# EAGLE design dynalo_SMD_MOD (EAGLE 9.4.2)
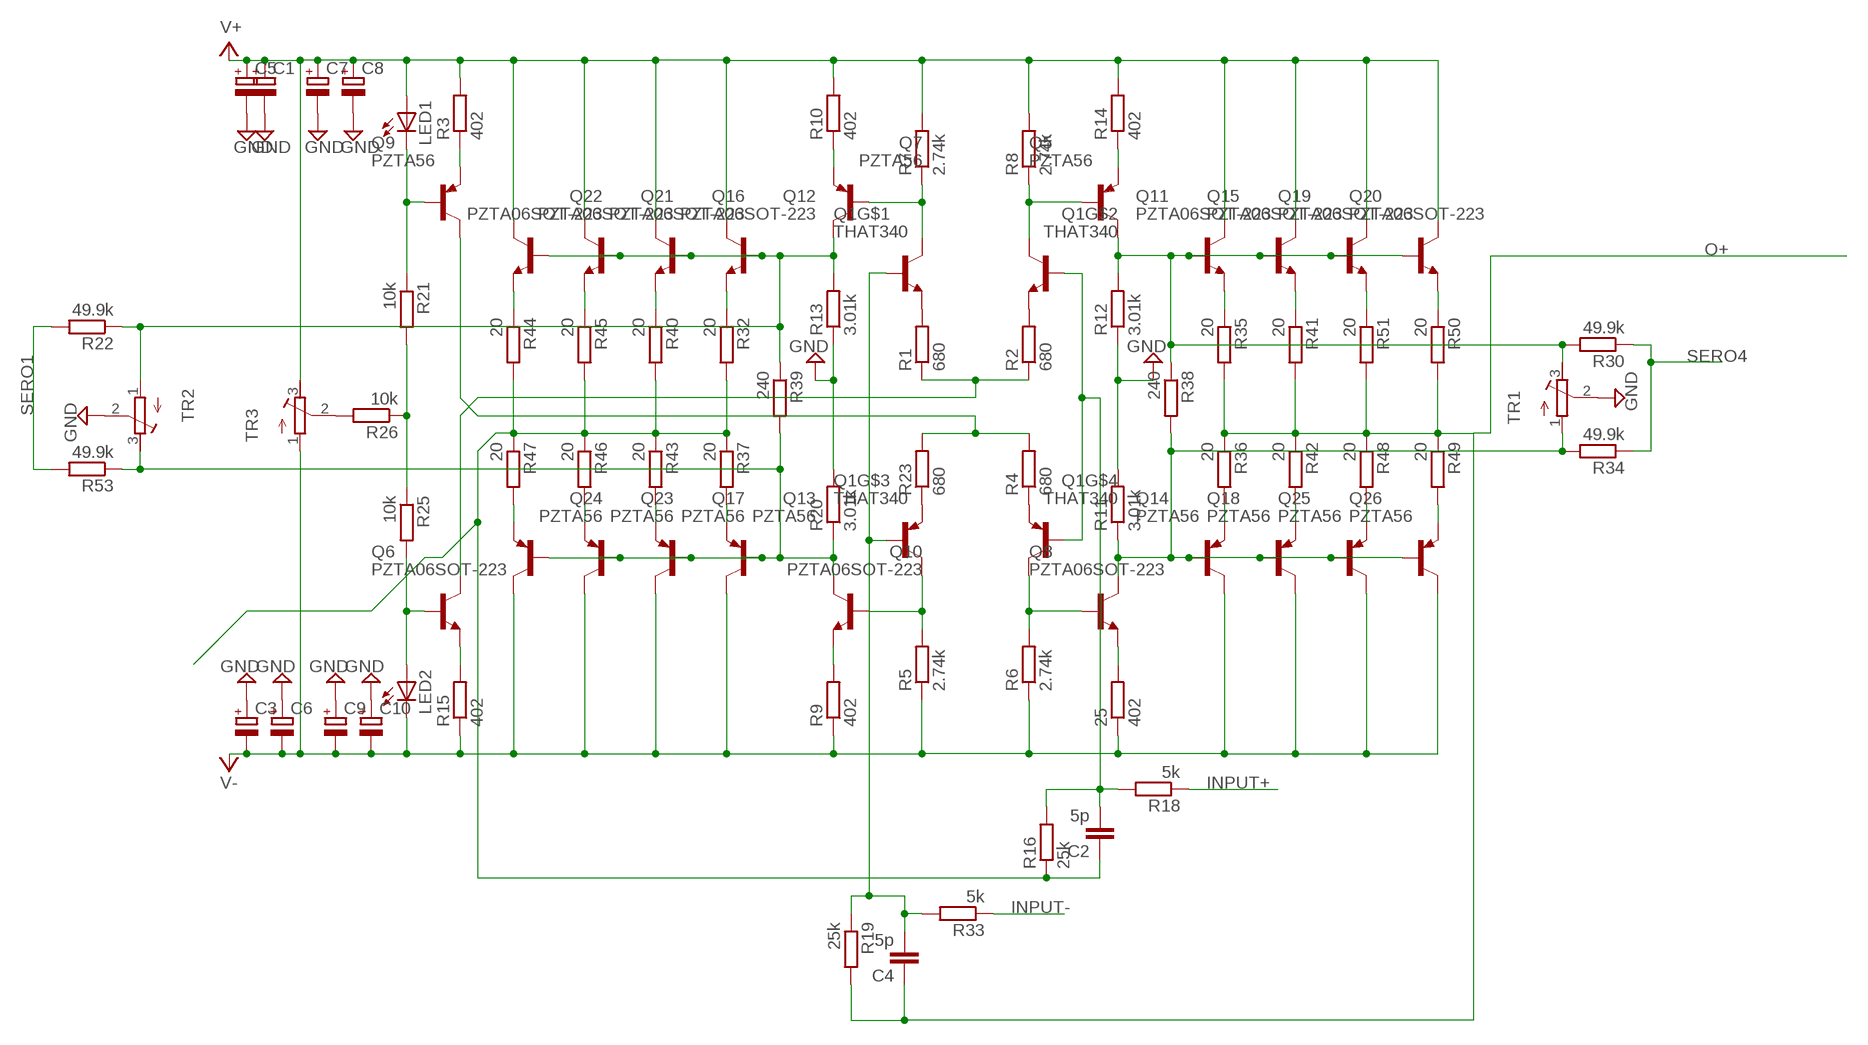
[diagram p0: schematic, sheet 1]

## Parts
25  402  R-EU_MELF0204W  [MINI_MELF-0204W]
C1  CPOL-EUSP-CAP-CX  [SP-CAP-CX]
C2  5p  C-EUC0805  [C0805]
C3  CPOL-EUSP-CAP-CX  [SP-CAP-CX]
C4  5p  C-EUC0805  [C0805]
C5  CPOL-EUSP-CAP-CX  [SP-CAP-CX]
C6  CPOL-EUSP-CAP-CX  [SP-CAP-CX]
C7  CPOL-EUSP-CAP-CX  [SP-CAP-CX]
C8  CPOL-EUSP-CAP-CX  [SP-CAP-CX]
C9  CPOL-EUSP-CAP-CX  [SP-CAP-CX]
C10  CPOL-EUSP-CAP-CX  [SP-CAP-CX]
LED1  LED5MM  [LED5MM]
LED2  LED5MM  [LED5MM]
Q1  THAT340  [DIP254P762X510-14]
Q5  PZTA56  [SOT223]
Q6  PZTA06SOT-223  [SOT223]
Q7  PZTA56  [SOT223]
Q8  PZTA06SOT-223  [SOT223]
Q9  PZTA56  [SOT223]
Q10  PZTA06SOT-223  [SOT223]
Q11  PZTA06SOT-223  [SOT223]
Q12  PZTA06SOT-223  [SOT223]
Q13  PZTA56  [SOT223]
Q14  PZTA56  [SOT223]
Q15  PZTA06SOT-223  [SOT223]
Q16  PZTA06SOT-223  [SOT223]
Q17  PZTA56  [SOT223]
Q18  PZTA56  [SOT223]
Q19  PZTA06SOT-223  [SOT223]
Q20  PZTA06SOT-223  [SOT223]
Q21  PZTA06SOT-223  [SOT223]
Q22  PZTA06SOT-223  [SOT223]
Q23  PZTA56  [SOT223]
Q24  PZTA56  [SOT223]
Q25  PZTA56  [SOT223]
Q26  PZTA56  [SOT223]
R1  680  R-EU_MELF0204W  [MINI_MELF-0204W]
R2  680  R-EU_MELF0204W  [MINI_MELF-0204W]
R3  402  R-EU_MELF0204W  [MINI_MELF-0204W]
R4  680  R-EU_MELF0204W  [MINI_MELF-0204W]
R5  2.74k  R-EU_MELF0204W  [MINI_MELF-0204W]
R6  2.74k  R-EU_MELF0204W  [MINI_MELF-0204W]
R7  2.74k  R-EU_MELF0204W  [MINI_MELF-0204W]
R8  2.74k  R-EU_MELF0204W  [MINI_MELF-0204W]
R9  402  R-EU_MELF0204W  [MINI_MELF-0204W]
R10  402  R-EU_MELF0204W  [MINI_MELF-0204W]
R11  3.01k  R-EU_MELF0204W  [MINI_MELF-0204W]
R12  3.01k  R-EU_MELF0204W  [MINI_MELF-0204W]
R13  3.01k  R-EU_MELF0204W  [MINI_MELF-0204W]
R14  402  R-EU_MELF0204W  [MINI_MELF-0204W]
R15  402  R-EU_MELF0204W  [MINI_MELF-0204W]
R16  25k  R-EU_MELF0204W  [MINI_MELF-0204W]
R18  5k  R-EU_MELF0204W  [MINI_MELF-0204W]
R19  25k  R-EU_MELF0204W  [MINI_MELF-0204W]
R20  3.01k  R-EU_MELF0204W  [MINI_MELF-0204W]
R21  10k  R-EU_MELF0204W  [MINI_MELF-0204W]
R22  49.9k  R-EU_MELF0204W  [MINI_MELF-0204W]
R23  680  R-EU_MELF0204W  [MINI_MELF-0204W]
R25  10k  R-EU_MELF0204W  [MINI_MELF-0204W]
R26  10k  R-EU_MELF0204W  [MINI_MELF-0204W]
R30  49.9k  R-EU_MELF0204W  [MINI_MELF-0204W]
R32  20  R-EU_MELF0204W  [MINI_MELF-0204W]
R33  5k  R-EU_MELF0204W  [MINI_MELF-0204W]
R34  49.9k  R-EU_MELF0204W  [MINI_MELF-0204W]
R35  20  R-EU_MELF0204W  [MINI_MELF-0204W]
R36  20  R-EU_MELF0204W  [MINI_MELF-0204W]
R37  20  R-EU_MELF0204W  [MINI_MELF-0204W]
R38  240  R-EU_MELF0204W  [MINI_MELF-0204W]
R39  240  R-EU_MELF0204W  [MINI_MELF-0204W]
R40  20  R-EU_MELF0204W  [MINI_MELF-0204W]
R41  20  R-EU_MELF0204W  [MINI_MELF-0204W]
R42  20  R-EU_MELF0204W  [MINI_MELF-0204W]
R43  20  R-EU_MELF0204W  [MINI_MELF-0204W]
R44  20  R-EU_MELF0204W  [MINI_MELF-0204W]
R45  20  R-EU_MELF0204W  [MINI_MELF-0204W]
R46  20  R-EU_MELF0204W  [MINI_MELF-0204W]
R47  20  R-EU_MELF0204W  [MINI_MELF-0204W]
R48  20  R-EU_MELF0204W  [MINI_MELF-0204W]
R49  20  R-EU_MELF0204W  [MINI_MELF-0204W]
R50  20  R-EU_MELF0204W  [MINI_MELF-0204W]
R51  20  R-EU_MELF0204W  [MINI_MELF-0204W]
R53  49.9k  R-EU_MELF0204W  [MINI_MELF-0204W]
TR1  R-TRIMM3296W  [RTRIM3296W]
TR2  R-TRIMM3296W  [RTRIM3296W]
TR3  R-TRIMM3296W  [RTRIM3296W]

## Nets
GND: C1.- C3.+ C5.- C6.+ C7.- C8.- C9.+ C10.+ R11.2 R12.1 R13.1 R20.2 TR1.2(S) TR2.2(S)
INPUT+: R18.1
INPUT-: R33.1
N$1: Q1.3(E) R1.2
N$2: Q1.12(E) R2.2
N$3: Q1.5(E) R23.1
N$4: Q1.10(E) R4.1
N$5: Q1.1(C) Q7.1(B) R7.1
N$6: Q1.14(C) Q5.1(B) R8.1
N$7: Q1.7(C) Q10.1(B) R5.2
N$8: Q1.8(C) Q8.1(B) R6.2
N$9: Q9.2(C) Q9.4(C) R4.2 R23.2
N$10: Q6.2(C) Q6.4(C) R1.1 R2.1
N$11: Q10.3(E) R9.2
N$12: Q7.3(E) R10.1
N$15: C4.2 Q1.2(B) Q1.6(B) R19.1 R33.2
N$16: C2.2 Q1.9(B) Q1.13(B) R16.2 R18.2
N$17: Q7.2(C) Q7.4(C) Q12.1(B) Q16.1(B) Q21.1(B) Q22.1(B) R13.2 R22.1 R39.1 TR2.1(A)
N$18: Q10.2(C) Q10.4(C) Q13.1(B) Q17.1(B) Q23.1(B) Q24.1(B) R20.1 R39.2 R53.1 TR2.3(E)
N$21: Q11.3(E) R35.1
N$22: Q5.2(C) Q5.4(C) Q11.1(B) Q15.1(B) Q19.1(B) Q20.1(B) R12.2 R30.2 R38.1 TR1.3(E)
N$23: 25.2 Q8.3(E)
N$24: Q14.3(E) R36.2
N$25: Q5.3(E) R14.1
N$26: Q9.3(E) R3.1
N$27: Q6.3(E) R15.2
N$28: Q18.3(E) R42.2
N$29: Q15.3(E) R41.1
N$30: Q19.3(E) R51.1
N$31: Q20.3(E) R50.1
N$32: Q25.3(E) R48.2
N$33: Q8.2(C) Q8.4(C) Q14.1(B) Q18.1(B) Q25.1(B) Q26.1(B) R11.1 R34.2 R38.2 TR1.1(A)
N$34: Q26.3(E) R49.2
N$36: R26.2 TR3.2(S)
N$37: R21.2 R25.1 R26.1
N$39: Q22.3(E) R44.1
N$40: Q21.3(E) R45.1
N$41: Q16.3(E) R40.1
N$42: Q12.3(E) R32.1
N$43: Q24.3(E) R47.2
N$44: Q23.3(E) R46.2
N$45: Q17.3(E) R43.2
N$46: Q13.3(E) R37.2
N$48: LED2.A Q6.1(B) R25.2
N$49: LED1.K(C) Q9.1(B) R21.1
O+: C4.1 R19.2 R35.2 R36.1 R41.2 R42.1 R48.1 R49.1 R50.2 R51.2
O-: C2.1 R16.1 R32.2 R37.1 R40.2 R43.1 R44.2 R45.2 R46.1 R47.1
SERO1: R22.2 R53.2
SERO4: R30.1 R34.1
V+: C1.+ C5.+ C7.+ C8.+ LED1.A Q11.2(C) Q11.4(C) Q12.2(C) Q12.4(C) Q15.2(C) Q15.4(C) Q16.2(C) Q16.4(C) Q19.2(C) Q19.4(C) Q20.2(C) Q20.4(C) Q21.2(C) Q21.4(C) Q22.2(C) Q22.4(C) R3.2 R7.2 R8.2 R10.2 R14.2 TR3.3(E)
V-: 25.1 C3.- C6.- C9.- C10.- LED2.K(C) Q13.2(C) Q13.4(C) Q14.2(C) Q14.4(C) Q17.2(C) Q17.4(C) Q18.2(C) Q18.4(C) Q23.2(C) Q23.4(C) Q24.2(C) Q24.4(C) Q25.2(C) Q25.4(C) Q26.2(C) Q26.4(C) R5.1 R6.1 R9.1 R15.1 TR3.1(A)

## Library data of the parts
25 R1-R16 R18-R23 R25 R26 R30 R32-R51 R53 = Vwvwbg:R-EU_: RESISTOR, European symbol
C1 C3 C5-C10 = Vwvwbg:CPOL-EU: POLARIZED CAPACITOR, European symbol
C2 C4 = Vwvwbg:C-EU: CAPACITOR, European symbol
LED1 LED2 = led:LED: LED OSRAM: - CHIPLED LG R971, LG N971, LY N971, LG Q971, LY Q971, LO R971, LY R971 LH N974, LH R974 LS Q976, LO Q976, LY Q976 LO Q996 - Hyper CHIPLED LW Q18S LB Q993, LB Q99A, LB R99A - SideLED LS A670, LO A670, LY A670, LG A670, LP A670 LB A673, LV A673, LT A673, LW A673 LH A674 LY A675 LS A676, LA A676, LO A676, LY A676, LW A676 LS A679, LY A679, LG A679 - Hyper Micro SIDELED® LS Y876, LA Y876, LO Y876, LY Y876 LT Y87S - SmartLED LW L88C, LW L88S LB L89C, LB L89S, LG L890 LS L89K, LO L89K, LY L89K LS L896, LA L896, LO L896, LY L896 - TOPLED LS T670, LO T670, LY T670, LG T670, LP T670 LSG T670, LSP T670, LSY T670, LOP T670, LYG T670 LG T671, LOG T671, LSG T671 LB T673, LV T673, LT T673, LW T673 LH T674 LS T676, LA T676, LO T676, LY T676, LB T676, LH T676, LSB T676, LW T676 LB T67C, LV T67C, LT T67C, LS T67K, LO T67K, LY T67K, LW E67C LS E67B, LA E67B, LO E67B, LY E67B, LB E67C, LV E67C, LT E67C LW T67C LS T679, LY T679, LG T679 LS T770, LO T770, LY T770, LG T770, LP T770 LB T773, LV T773, LT T773, LW T773 LH T774 LS E675, LA E675, LY E675, LS T675 LS T776, LA T776, LO T776, LY T776, LB T776 LHGB T686 LT T68C, LB T68C - Hyper Mini TOPLED® LB M676 - Mini TOPLED Santana® LG M470 LS M47K, LO M47K, LY M47K Source: http://www.osram.convergy.de LUXEON: - LUMILED® LXK2-PW12-R00, LXK2-PW12-S00, LXK2-PW14-U00, LXK2-PW14-V00 LXK2-PM12-R00, LXK2-PM12-S00, LXK2-PM14-U00 LXK2-PE12-Q00, LXK2-PE12-R00, LXK2-PE12-S00, LXK2-PE14-T00, LXK2-PE14-U00 LXK2-PB12-K00, LXK2-PB12-L00, LXK2-PB12-M00, LXK2-PB14-N00, LXK2-PB14-P00, LXK2-PB14-Q00 LXK2-PR12-L00, LXK2-PR12-M00, LXK2-PR14-Q00, LXK2-PR14-R00 LXK2-PD12-Q00, LXK2-PD12-R00, LXK2-PD12-S00 LXK2-PH12-R00, LXK2-PH12-S00 LXK2-PL12-P00, LXK2-PL12-Q00, LXK2-PL12-R00 Source: www.luxeon.com KINGBRIGHT: KA-3528ASYC Source: www.kingbright.com
Q1 = transistor-arrays:THAT340
Q5 Q7 Q9 Q13 Q14 Q17 Q18 Q23-Q26 = Vwvwbg:PZTA56
Q6 Q8 Q10-Q12 Q15 Q16 Q19-Q22 = Vwvwbg:PZTA06
TR1-TR3 = resistor:R-TRIMM: Trimm resistor

## Board
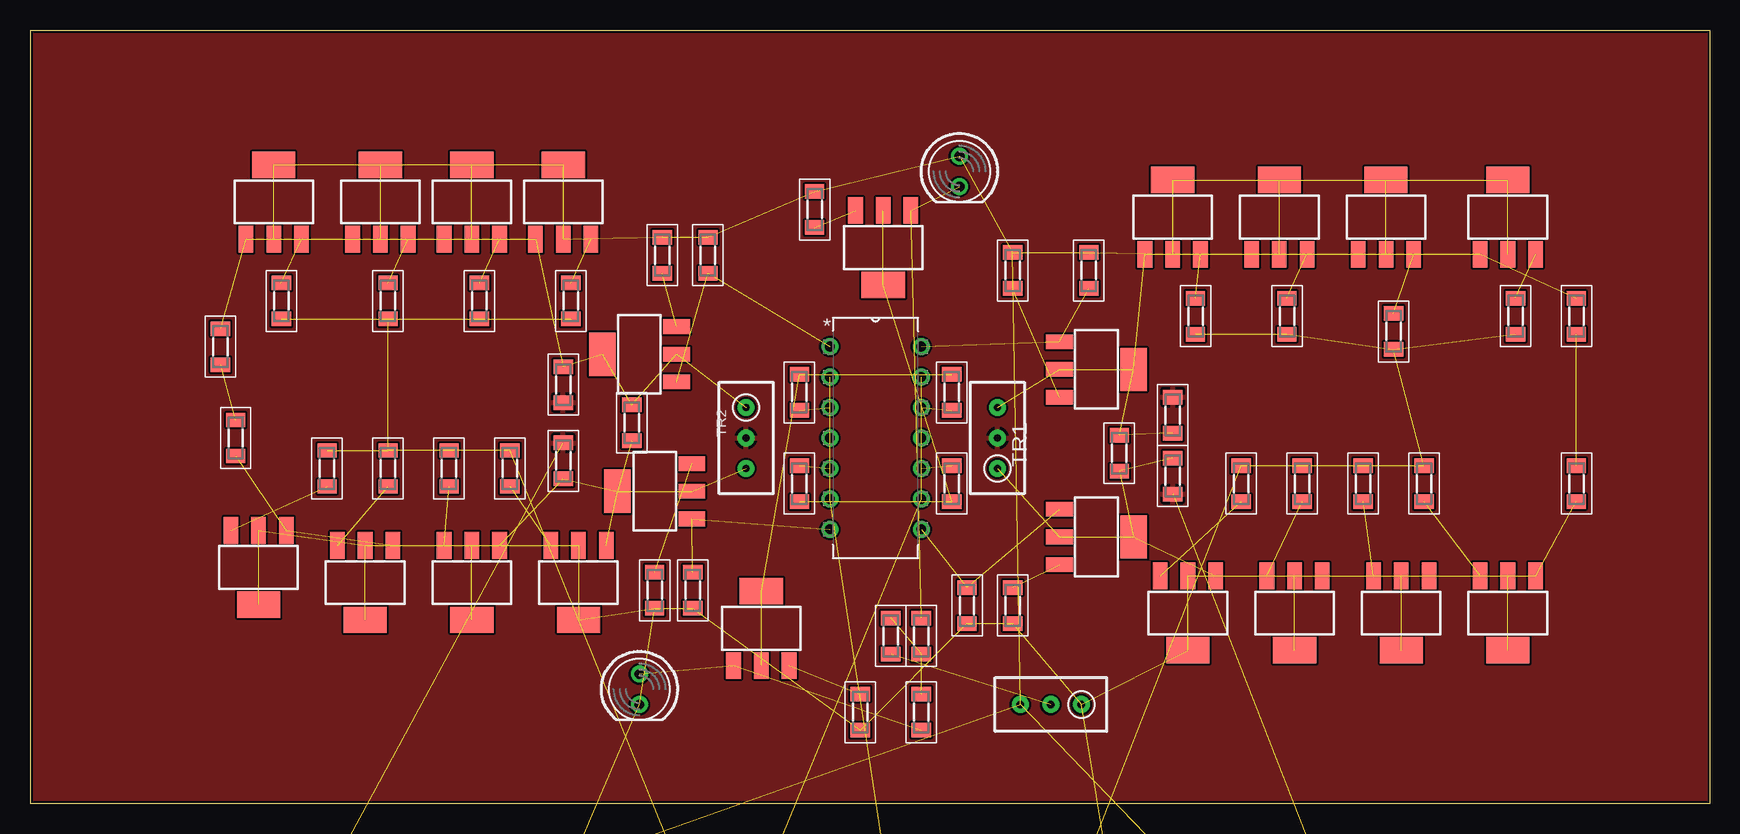
[diagram p1: board, top side]
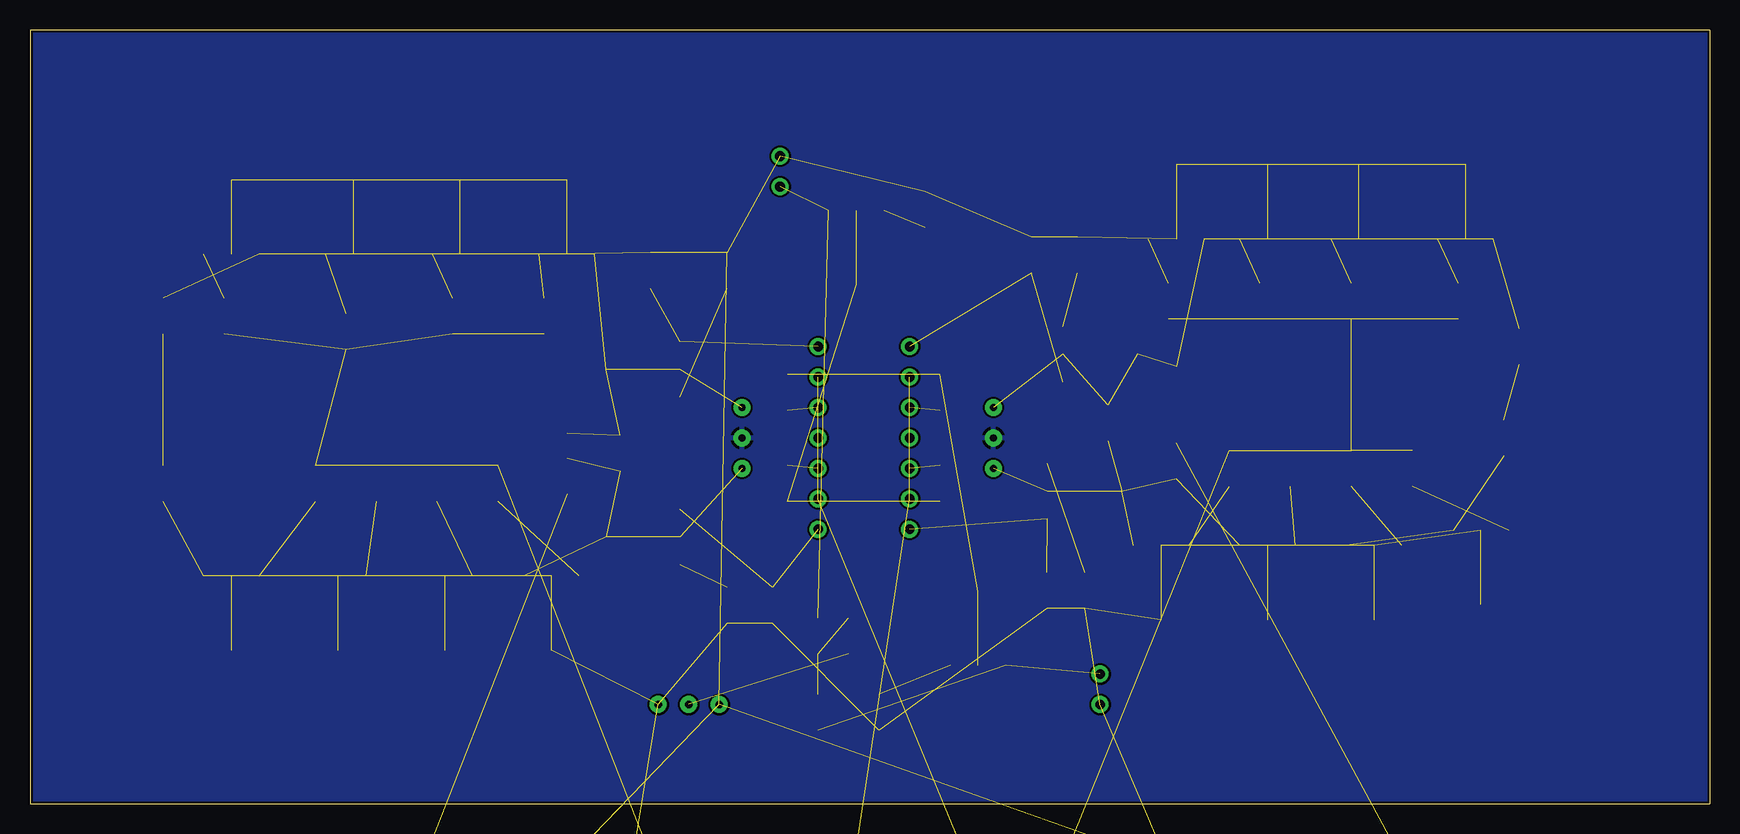
[diagram p2: board, bottom side, seen from below]

Size 140 x 64.5 mm. Coordinates in mm from the lower left corner, seen from the top.
Outline: 0,64.5 140,64.5 140,0 0,0 0,64.5
Copper layers (1*16): Top 0.035mm / dielectric 1.5mm / Bottom 0.035mm
Design rules "default": minimum track width 6mil, minimum drill 0.3mm, track to track 7mil, track to pad 7mil, pad to pad 7mil, via to via 7mil, smd to smd 7mil, copper to edge 8mil, drill to drill 8mil, minimum pad ring 6mil, minimum via ring 6mil, stop-mask expansion 4mil, vias tented up to drill 0mil, thermal gap 10mil

### Footprints (pad centres in the part's own frame; a part is rotated, then mirrored left to right if it is on the bottom)
MINI_MELF-0204W = smd 1.2 x 1.6: 1 -1.5,0; 2 1.5,0
SP-CAP-CX = smd 2.062 x 2.4: + -2.754,0; - 3.707,0
C0805 = smd 1.3 x 1.5: 1 -0.95,0; 2 0.95,0
LED5MM = drill 0.813 pad 1.422: A -1.27,0; K 1.27,0
DIP254P762X510-14 = drill 0.8 pad 1.422: 1 -7.62,15.24; 2 -7.62,12.7; 3 -7.62,10.16; 4 -7.62,7.62; 5 -7.62,5.08; 6 -7.62,2.54; 7 -7.62,0; 8 0,0; 9 0,2.54; 10 0,5.08; 11 0,7.62; 12 0,10.16; 13 0,12.7; 14 0,15.24
SOT223 = smd 1.219 x 2.235: 1 -2.311,-3.099; 2 0,-3.099; 3 2.311,-3.099 | smd 3.6 x 2.2: 4 0,3.099
RTRIM3296W = drill 0.61 pad 1.422: 1 0,-2.54; 2 0,0; 3 0,2.54

### Placement (x,y rotation side)
25  81.92,16.51 90 top
C1  107.31,-14.61 0 top  (outside the outline)
C2  60.96,-15.24 90 bottom  (outside the outline)
C3  99.69,-42.55 180 top  (outside the outline)
C4  76.2,-36.2 270 bottom  (outside the outline)
C5  26.04,-10.79 180 top  (outside the outline)
C6  25.4,-42.55 0 top  (outside the outline)
C7  26.04,-10.79 0 bottom  (outside the outline)
C8  108.58,-22.23 0 top  (outside the outline)
C9  25.4,-42.55 180 bottom  (outside the outline)
C10  99.69,-42.55 0 bottom  (outside the outline)
LED1  77.47,52.7 270 top
LED2  50.8,9.53 270 top
Q1  74.3,22.86 0 top
Q5  88.9,36.2 270 top
Q6  60.96,14.61 0 top
Q7  50.8,37.47 90 top
Q8  88.9,22.23 270 top
Q9  71.12,46.35 180 top
Q10  52.07,26.04 90 top
Q11  95.25,48.9 0 top
Q12  20.32,50.16 0 top
Q13  19.05,19.68 180 top
Q14  96.52,15.88 180 top
Q15  123.19,48.9 0 top
Q16  29.21,50.16 0 top
Q17  36.83,18.41 180 top
Q18  123.19,15.88 180 top
Q19  104.14,48.9 0 top
Q20  113.03,48.9 0 top
Q21  36.83,50.16 0 top
Q22  44.45,50.16 0 top
Q23  27.94,18.41 180 top
Q24  45.72,18.41 180 top
Q25  114.3,15.88 180 top
Q26  105.41,15.88 180 top
R1  64.14,34.29 270 top
R2  76.83,34.29 270 top
R3  65.41,49.53 90 top
R4  76.83,26.67 270 top
R5  55.24,17.78 90 top
R6  78.11,16.51 90 top
R7  56.52,45.72 90 top
R8  88.27,44.45 90 top
R9  52.07,17.78 90 top
R10  52.7,45.72 90 top
R11  95.25,27.3 270 top
R12  95.25,32.38 270 top
R13  44.45,34.92 90 top
R14  81.92,44.45 90 top
R15  69.22,7.62 90 top
R16  58.42,-14.61 90 bottom  (outside the outline)
R18  53.98,-13.97 180 bottom  (outside the outline)
R19  73.03,-36.83 90 bottom  (outside the outline)
R20  44.45,28.57 90 top
R21  74.3,13.97 270 top
R22  15.88,38.1 270 top
R23  64.14,26.67 270 top
R25  74.3,7.62 270 top
R26  71.75,13.97 270 top
R30  128.91,40.64 90 top
R32  20.95,41.91 270 top
R33  67.94,-38.1 180 bottom  (outside the outline)
R34  128.91,26.67 270 top
R35  97.16,40.64 270 top
R36  100.97,26.67 270 top
R37  24.77,27.94 270 top
R38  90.81,29.21 270 top
R39  50.16,31.75 270 top
R40  29.84,41.91 270 top
R41  123.83,40.64 270 top
R42  116.2,26.67 270 top
R43  34.92,27.94 270 top
R44  45.09,41.91 270 top
R45  37.47,41.91 270 top
R46  29.84,27.94 270 top
R47  40.01,27.94 270 top
R48  111.12,26.67 270 top
R49  106.05,26.67 270 top
R50  113.67,39.37 270 top
R51  104.78,40.64 270 top
R53  17.14,30.48 90 top
TR1  80.64,30.48 0 top
TR2  59.69,30.48 180 top
TR3  85.09,8.26 90 top

### Tracks (layer width: path | path; a pad name or v marks a point on that pad's centre or on a via)
GND  (8 unrouted)
  pour Top: -3.17,68.58 153.03,68.58 153.03,-2.54 -3.17,-2.54
  pour Bottom: -3.17,68.58 154.31,68.58 154.31,-6.35 -3.17,-6.35
N$1  (1 unrouted)
N$2  (1 unrouted)
N$3  (1 unrouted)
N$4  (1 unrouted)
N$5  (2 unrouted)
N$6  (2 unrouted)
N$7  (2 unrouted)
N$8  (2 unrouted)
N$9  (3 unrouted)
N$10  (3 unrouted)
N$11  (1 unrouted)
N$12  (1 unrouted)
N$15  (4 unrouted)
N$16  (4 unrouted)
N$17  (9 unrouted)
N$18  (9 unrouted)
N$21  (1 unrouted)
N$22  (9 unrouted)
N$23  (1 unrouted)
N$24  (1 unrouted)
N$25  (1 unrouted)
N$26  (1 unrouted)
N$27  (1 unrouted)
N$28  (1 unrouted)
N$29  (1 unrouted)
N$30  (1 unrouted)
N$31  (1 unrouted)
N$32  (1 unrouted)
N$33  (9 unrouted)
N$34  (1 unrouted)
N$36  (1 unrouted)
N$37  (2 unrouted)
N$39  (1 unrouted)
N$40  (1 unrouted)
N$41  (1 unrouted)
N$42  (1 unrouted)
N$43  (1 unrouted)
N$44  (1 unrouted)
N$45  (1 unrouted)
N$46  (1 unrouted)
N$48  (2 unrouted)
N$49  (2 unrouted)
O+  (9 unrouted)
O-  (9 unrouted)
SERO1  (1 unrouted)
SERO4  (1 unrouted)
V+  (26 unrouted)
V-  (26 unrouted)

### Text on the board
tPlace: Dynalo
tNames: VWVWBG